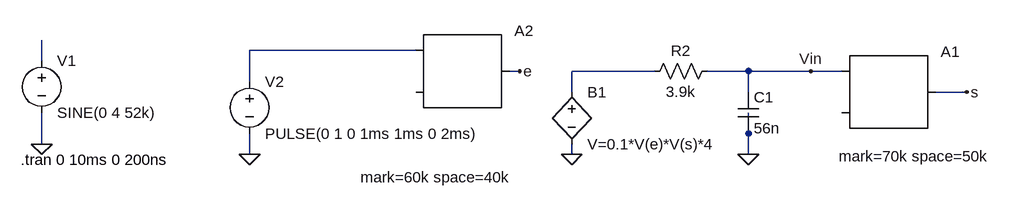
[diagram p0: schematic Draft2.asc]
Draft2.asc, the LTspice schematic file:
Version 4
SHEET 1 880 680
WIRE -176 112 -432 112
WIRE -752 128 -752 96
WIRE -16 144 -32 144
WIRE 192 144 64 144
WIRE 336 144 272 144
WIRE 432 144 336 144
WIRE 480 144 432 144
WIRE -432 160 -432 112
WIRE 64 176 64 144
WIRE 336 176 336 144
WIRE 672 176 624 176
WIRE 336 240 336 208
WIRE -752 256 -752 208
WIRE -432 272 -432 240
WIRE 64 272 64 256
WIRE 336 272 336 240
FLAG 64 272 0
FLAG 336 272 0
FLAG -752 256 0
FLAG 672 176 s
FLAG 432 144 Vin
FLAG -432 272 0
FLAG -16 144 e
SYMBOL voltage -752 112 R0
WINDOW 123 0 0 Left 0
WINDOW 39 0 0 Left 0
SYMATTR InstName V1
SYMATTR Value SINE(0 4 52k)
SYMBOL SpecialFunctions\\modulate 480 144 R0
WINDOW 3 -5 131 Left 2
SYMATTR Value mark=70k space=50k
SYMATTR InstName A1
SYMBOL bv 64 160 R0
SYMATTR InstName B1
SYMATTR Value V=0.1*V(e)*V(s)*4
SYMBOL res 288 128 R90
WINDOW 0 0 56 VBottom 2
WINDOW 3 32 56 VTop 2
SYMATTR InstName R2
SYMATTR Value 3.9k
SYMBOL cap 320 176 R0
SYMATTR InstName C1
SYMATTR Value 56n
SYMBOL SpecialFunctions\\modulate -176 112 R0
WINDOW 3 -85 195 Left 2
SYMATTR Value mark=60k space=40k
SYMATTR InstName A2
SYMBOL voltage -432 144 R0
WINDOW 123 0 0 Left 0
WINDOW 39 0 0 Left 0
SYMATTR InstName V2
SYMATTR Value PULSE(0 1 0 1ms 1ms 0 2ms)
TEXT -784 280 Left 2 !.tran 0 10ms 0 200ns

The netlist it stands for:
* Draft2.asc
V1 N002 0 SINE(0 4 52k)
A1 Vin 0 0 0 0 0 s 0 MODULATOR mark=70k space=50k
B1 N003 0 V=0.1*V(e)*V(s)*4
R2 Vin N003 3.9k
C1 Vin 0 56n
A2 N001 0 0 0 0 0 e 0 MODULATOR mark=60k space=40k
V2 N001 0 PULSE(0 1 0 1ms 1ms 0 2ms)
.tran 0 10ms 0 200ns
.backanno
.end

* Results of the author's LTspice run, read from the files saved beside the schematic
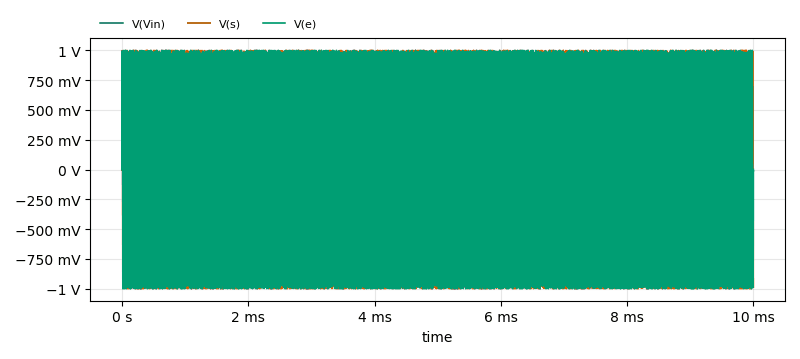
[diagram p1: Transient Analysis of Draft2.asc, plotted from the saved traces]
* Transient Analysis, 1 run:
*   V(Vin): min -133.8 mV, max 119.4 mV, average -6.111 mV, rms 42.91 mV, last -9.448 mV
*   V(s): min -1 V, max 1 V, average 262.7 µV, rms 707.1 mV, last -984.8 mV
*   V(e): min -1 V, max 1 V, average -514 nV, rms 707.1 mV, last -9.094 µV